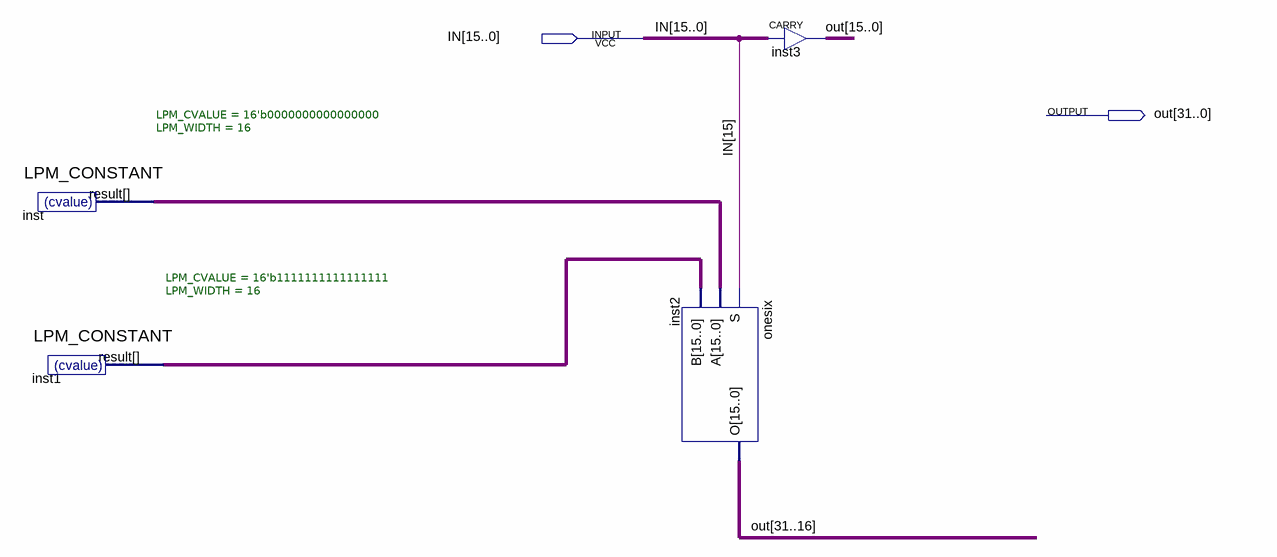
[diagram p0: schematic sheet]
// Quartus schematic signExtend.bdf as structural Verilog: 4 symbols, 2 pins
module signExtend (
  input  [15:0] IN,
  output [31:0] out
);

  wire [15:0] inst1_result, inst_result;

  LPM_CONSTANT #(.LPM_CVALUE(16'b0000000000000000), .LPM_WIDTH(16)) inst (.result(inst_result));
  LPM_CONSTANT #(.LPM_CVALUE(16'b1111111111111111), .LPM_WIDTH(16)) inst1 (.result(inst1_result));
  onesix inst2 (.S(IN[15]), .A(inst_result), .B(inst1_result), .O(out[31:16]));
  CARRY inst3[15:0] (.IN(IN), .OUT(out[15:0]));
endmodule
